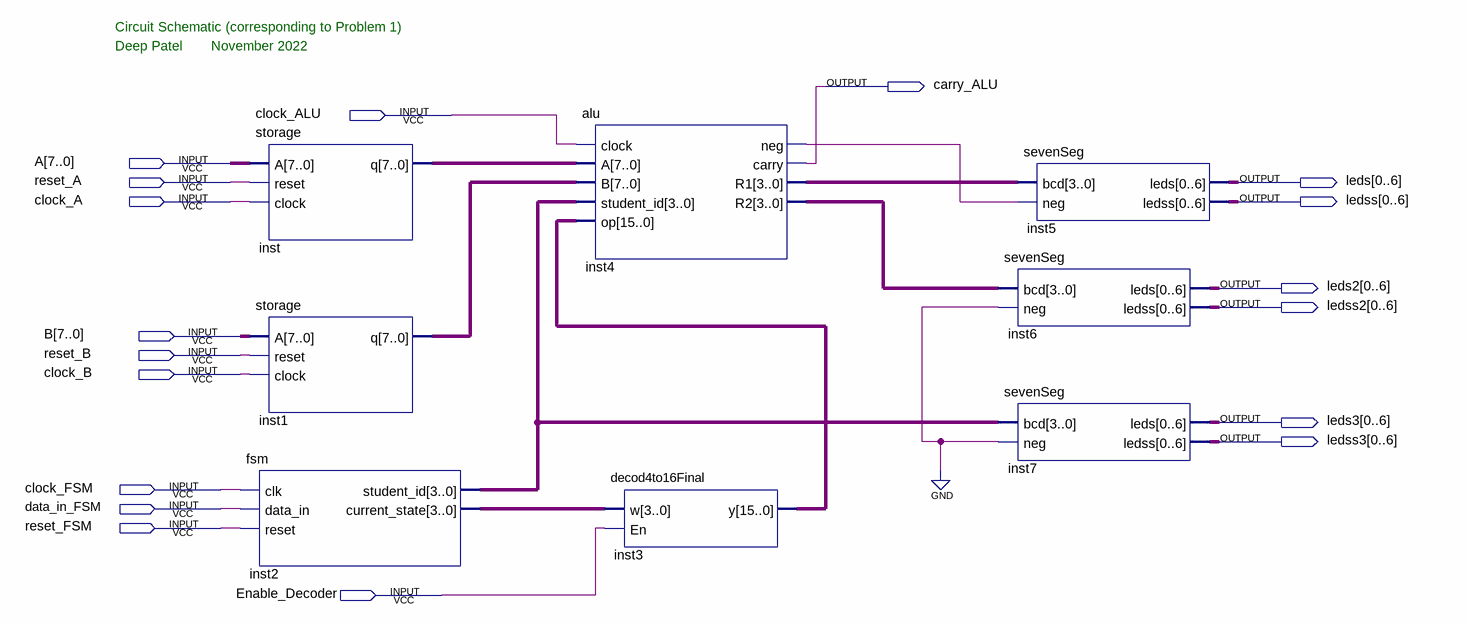
[diagram p0: schematic sheet]
// Quartus schematic block.bdf as structural Verilog: 8 symbols, 18 pins
module block (
  input  clock_ALU,
  input  [7:0] A,
  input  reset_A,
  input  clock_A,
  input  [7:0] B,
  input  reset_B,
  input  clock_B,
  input  clock_FSM,
  input  data_in_FSM,
  input  reset_FSM,
  input  Enable_Decoder,
  output carry_ALU,
  output [0:6] leds,
  output [0:6] ledss,
  output [0:6] leds2,
  output [0:6] ledss2,
  output [0:6] leds3,
  output [0:6] ledss3
);

  wire inst4_neg;
  wire [3:0] inst2_current_state, inst2_student_id, inst4_r1, inst4_r2;
  wire [7:0] inst1_q, inst_q;
  wire [15:0] inst3_y;

  fsm inst2 (
    .clk(clock_FSM), .data_in(data_in_FSM), .reset(reset_FSM), .student_id(inst2_student_id),
    .current_state(inst2_current_state));
  storage inst (.A(A), .reset(reset_A), .clock(clock_A), .q(inst_q));
  storage inst1 (.A(B), .reset(reset_B), .clock(clock_B), .q(inst1_q));
  alu inst4 (
    .clock(clock_ALU), .A(inst_q), .B(inst1_q), .student_id(inst2_student_id), .op(inst3_y), .neg(inst4_neg),
    .carry(carry_ALU), .R1(inst4_r1), .R2(inst4_r2));
  decod4to16Final inst3 (.w(inst2_current_state), .En(Enable_Decoder), .y(inst3_y));
  sevenSeg inst6 (.bcd(inst4_r2), .neg(1'b0), .leds(leds2), .ledss(ledss2));
  sevenSeg inst7 (.bcd(inst2_student_id), .neg(1'b0), .leds(leds3), .ledss(ledss3));
  sevenSeg inst5 (.bcd(inst4_r1), .neg(inst4_neg), .leds(leds), .ledss(ledss));

  // Notes on the sheet:
  //   Circuit Schematic (corresponding to Problem 1)
  //   Deep Patel
  //   November 2022
endmodule
